# EAGLE schematic Main (EAGLE 8.1.0)
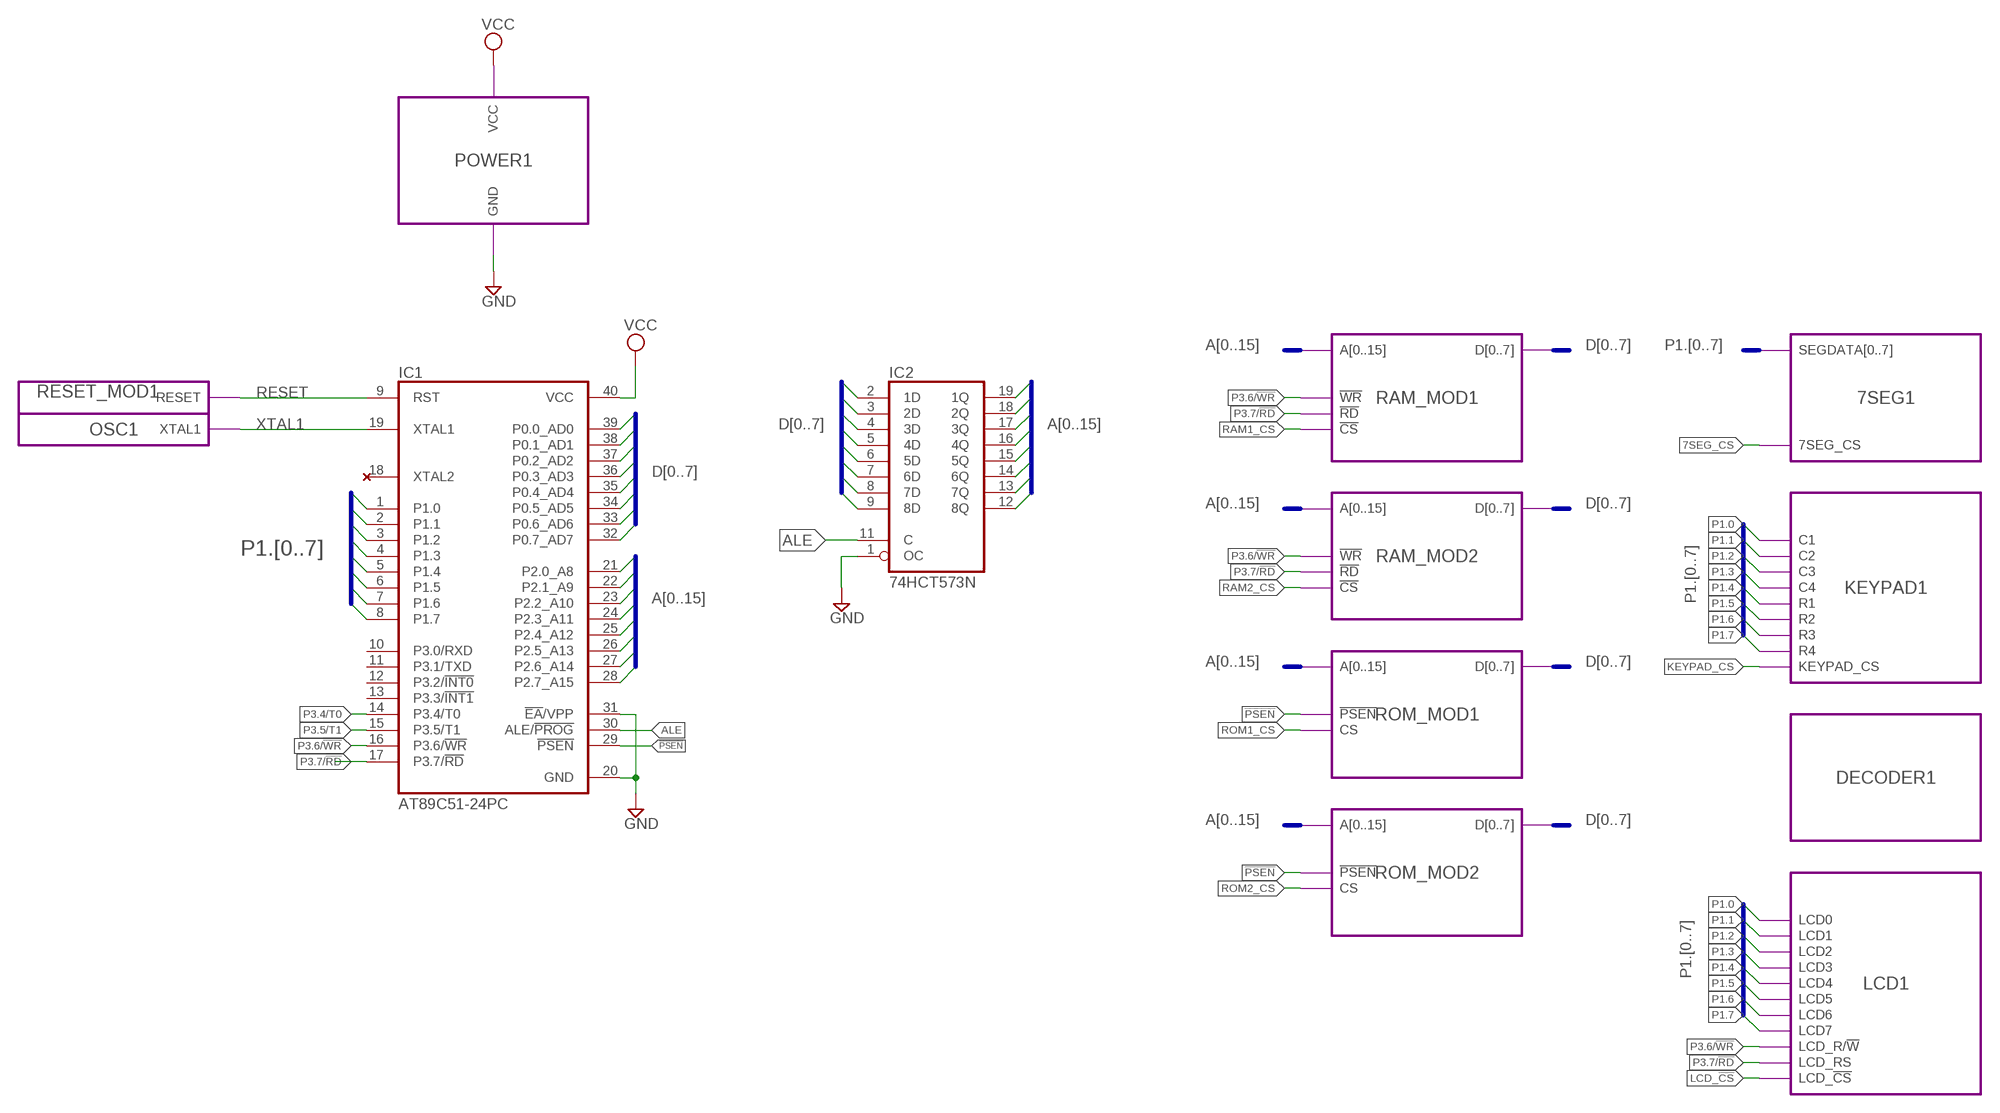
[diagram p0: schematic, sheet 1]

## Parts
IC1  AT89C51-24PC  [DIL40]
IC2  74HCT573N  [DIL20]
U$1  NC  [NC]

## Module instances
RAM_MOD1 = RAM_MODULE
RESET_MOD1 = RESET_MOD
OSC1 = OSCILLATOR
POWER1 = POWER_MOD
RAM_MOD2 = RAM_MODULE
ROM_MOD1 = ROM_MODULE
ROM_MOD2 = ROM_MODULE
7SEG1 = 7-SEGMENT
KEYPAD1 = KPAD_MOD
DECODER1 = DECODER_MODULE
LCD1 = LCD_MODULE

## Nets
7SEG_CS: port 7SEG1.7SEG_CS
!PSEN!: IC1.29(!PSEN) ; port ROM_MOD1.!PSEN! ROM_MOD2.!PSEN!
A0: IC2.19(1Q)
A1: IC2.18(2Q)
A2: IC2.17(3Q)
A3: IC2.16(4Q)
A4: IC2.15(5Q)
A5: IC2.14(6Q)
A6: IC2.13(7Q)
A7: IC2.12(8Q)
A8: IC1.21(P2.0_A8)
A9: IC1.22(P2.1_A9)
A10: IC1.23(P2.2_A10)
A11: IC1.24(P2.3_A11)
A12: IC1.25(P2.4_A12)
A13: IC1.26(P2.5_A13)
A14: IC1.27(P2.6_A14)
A15: IC1.28(P2.7_A15)
ALE: IC1.30(ALE/!PROG) IC2.11(C)
D0: IC1.39(P0.0_AD0) IC2.2(1D)
D1: IC1.38(P0.1_AD1) IC2.3(2D)
D2: IC1.37(P0.2_AD2) IC2.4(3D)
D3: IC1.36(P0.3_AD3) IC2.5(4D)
D4: IC1.35(P0.4_AD4) IC2.6(5D)
D5: IC1.34(P0.5_AD5) IC2.7(6D)
D6: IC1.33(P0.6_AD6) IC2.8(7D)
D7: IC1.32(P0.7_AD7) IC2.9(8D)
GND: IC1.20(GND) IC1.31(!EA!/VPP) IC2.1(OC) ; port POWER1.GND
KEYPAD_CS: port KEYPAD1.KEYPAD_CS
LCD_!CS!: port LCD1.LCD_!CS
P1.0: IC1.1(P1.0) ; port KEYPAD1.C1 LCD1.LCD0
P1.1: IC1.2(P1.1) ; port KEYPAD1.C2 LCD1.LCD1
P1.2: IC1.3(P1.2) ; port KEYPAD1.C3 LCD1.LCD2
P1.3: IC1.4(P1.3) ; port KEYPAD1.C4 LCD1.LCD3
P1.4: IC1.5(P1.4) ; port KEYPAD1.R1 LCD1.LCD4
P1.5: IC1.6(P1.5) ; port KEYPAD1.R2 LCD1.LCD5
P1.6: IC1.7(P1.6) ; port KEYPAD1.R3 LCD1.LCD6
P1.7: IC1.8(P1.7) ; port KEYPAD1.R4 LCD1.LCD7
P3.4/T0: IC1.14(P3.4/T0)
P3.5/T1: IC1.15(P3.5/T1)
P3.6/!WR!: IC1.16(P3.6/!WR) ; port RAM_MOD1.!WR! RAM_MOD2.!WR! LCD1.LCD_R/!W
P3.7/!RD!: IC1.17(P3.7/!RD) ; port RAM_MOD1.!RD! RAM_MOD2.!RD! LCD1.LCD_RS
RAM1_CS: port RAM_MOD1.!CS!
RAM2_CS: port RAM_MOD2.!CS!
RESET: IC1.9(RST) ; port RESET_MOD1.RESET
ROM1_CS: port ROM_MOD1.CS
ROM2_CS: port ROM_MOD2.CS
VCC: IC1.40(VCC) ; port POWER1.VCC
XTAL1: IC1.19(XTAL1) ; port OSC1.XTAL1
Unconnected: IC1.10(P3.0/RXD) IC1.11(P3.1/TXD) IC1.12(P3.2/!INT0) IC1.13(P3.3/!INT1) IC1.18(XTAL2)

## Buses
P1.[0..7]
A[0..15]
D[0..7]

## Power pins joined to a net without a drawn wire
GND: IC2.10(GND)
VCC: IC2.20(VCC)

## Library data of the parts
IC1 = atmel:AT89C51-*: 8-bit Microcontroller with 4K Bytes Flash Not Recommended for New Designs. Use AT89S51. Source: http://www.atmel.com/dyn/resources/prod_documents/doc0265.; OC_FARNELL: unknown; OC_NEWARK: unknown
IC2 = 74xx-eu:74*573: 8-bit D latch BUS DRIVER
U$1 = Miscellaneous:NC: No Connect - NC Package created by Collin MD Peterson Description: No Connect Symbol without any pins (empty package associated with symbol)

## Module RAM_MODULE
Ports: D[0..7](io) A[0..15](in) !WR!(in) !RD!(in) !CS!(in)
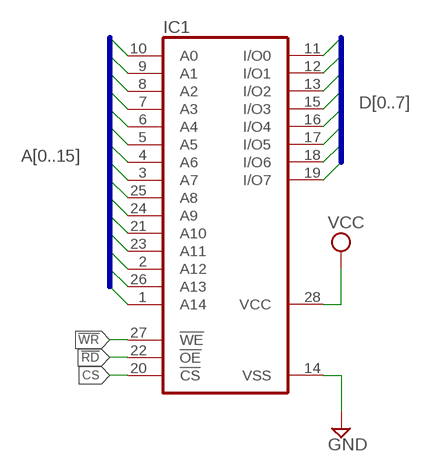
[diagram p1: schematic, module RAM_MODULE, sheet 1]

### Parts
IC1  62256P  [DIL28-6]

### Nets
!RD!: IC1.22(!OE)
!WR!: IC1.27(!WE)
A0: IC1.10(A0)
A1: IC1.9(A1)
A2: IC1.8(A2)
A3: IC1.7(A3)
A4: IC1.6(A4)
A5: IC1.5(A5)
A6: IC1.4(A6)
A7: IC1.3(A7)
A8: IC1.25(A8)
A9: IC1.24(A9)
A10: IC1.21(A10)
A11: IC1.23(A11)
A12: IC1.2(A12)
A13: IC1.26(A13)
A14: IC1.1(A14)
CS: IC1.20(!CS)
D0: IC1.11(I/O0)
D1: IC1.12(I/O1)
D2: IC1.13(I/O2)
D3: IC1.15(I/O3)
D4: IC1.16(I/O4)
D5: IC1.17(I/O5)
D6: IC1.18(I/O6)
D7: IC1.19(I/O7)
GND: IC1.14(VSS)
VCC: IC1.28(VCC)

### Buses
A[0..15]
D[0..7]

### Library data of the parts
IC1 = memory-hitachi:62256P: MEMORY; OC_FARNELL: unknown; OC_NEWARK: unknown

## Module RESET_MOD
Ports: RESET(out)
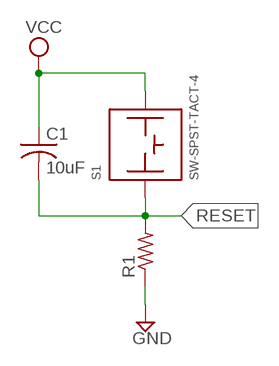
[diagram p2: schematic, module RESET_MOD, sheet 1]

### Parts
C1  10uF  C-US025-025X050  [C025-025X050]
R1  R-US_0207/10  [0207/10]
S1  SW-SPST-TACT-4  [SW-SPST-TACT-4]

### Nets
GND: R1.1
RESET: C1.2 R1.2 S1.1B
VCC: C1.1 S1.2A(2B)
Unconnected: S1.1A S1.2B(2A)

### Library data of the parts
C1 = rcl:C-US: CAPACITOR, American symbol
R1 = rcl:R-US_: RESISTOR, American symbol
S1 = Switches:SW-SPST-TACT-4: SW-SPST-TACT-4 - Tactile Switch (Pushbutton) Package created by Collin MD Peterson Description: Single-Pull, Single-Throw Tactile Pushbutton 4 pins (1A & 1B connected, 2A & 2B connected) Uses swap level 0 (pins 1A and 2A) and 1 (pins 1B and 2B) Dimensions: Pins: Size: 6.5mm x 4.5mm Diameter: 1mm Case: Size: 6mm x 6mm Works For: TF25 Through Hole

## Module OSCILLATOR
Ports: XTAL1(out)
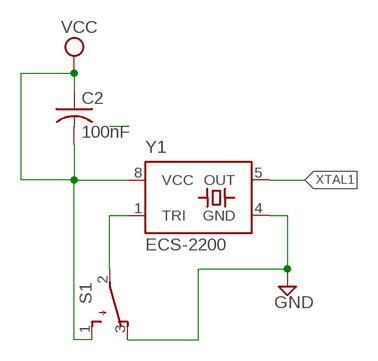
[diagram p3: schematic, module OSCILLATOR, sheet 1]

### Parts
C2  100nF  C-US025-025X050  [C025-025X050]
S1  SW-SPDT-TOG-3  [SW-SPDT-TOG-3]
Y1  ECS-2200  [ECS-2200]

### Nets
GND: S1.3 Y1.4(GND)
N$2: S1.2 Y1.1(TRI)
VCC: C2.1 C2.2 S1.1 Y1.8(VCC)
XTAL1: Y1.5(OUT)

### Library data of the parts
C2 = rcl:C-US: CAPACITOR, American symbol
S1 = Switches:SW-SPDT-TOG-3: SW-SPDT-TOG-3 - Toggle Switch Package created by Collin MD Peterson Description: Single-Pull, Double-Throw Toggle Switch 3 pin (1 = position 1, 2 = common, 3 = position 3) Dimensions: Pins: Size: 75mil x 400mil Diameter: 75mil Case: Size: 500mil x 270mil Works For: 100SP1 Through Hole
Y1 = Oscillators:ECS-2200: ECS-2200 Series - Clock Oscillator Package created by Collin MD Peterson Specs: ECS-2200B 12.000 MHz Dimensions: Pins: Size: 7.62mm x 7.62mm Diameter: 0.5mm Case: Size: 13.2mm x 13.2mm

## Module POWER_MOD
Ports: VCC(pwr) GND(pwr)
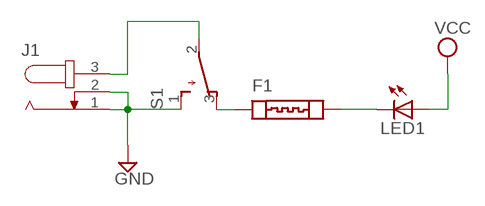
[diagram p4: schematic, module POWER_MOD, sheet 1]

### Parts
F1  FUSE-5X20  [FUSE-5X20]
J1  JACK-PLUG0  [SPC4077]
LED1  LED5MM  [LED5MM]
S1  SW-SPDT-TOG-3  [SW-SPDT-TOG-3]

### Nets
GND: J1.1 J1.2 S1.1
N$1: F1.2A LED1.K(C)
N$2: F1.1A S1.3
N$5: J1.3 S1.2
VCC: LED1.A
Unconnected: F1.1B F1.2B

### Library data of the parts
F1 = Fuses:FUSE-5X20: Generic Fuse Holder - 4 pin Package created by Collin MD Peterson Description: 4 pins (1A & 1B connected, 2A & 2B connected) Uses swap level 0 (pins 1A and 2A) and 1 (pins 1B and 2B) Dimensions: Fuse: F2400-ND (217 Series, 5x20mm, 200x800mil) Holder: F4189-ND (4.8mm x 3.8mm) Pins: 200mil x 700mil
J1 = con-jack:JACK-PLUG: DC POWER JACK Power Jack, DC, Right Angle, Through Hole, Rated 5A at 16VDC, PC Terminals Distributor: Farnell (www.Farnell.de) Drawing: 84N1161.pdf / 84N1162.pdf Manufacturer: SPC Technology (www.spctechnology.com) Type: SPC4077 / SPC 4078; OC_FARNELL: unknown; OC_NEWARK: unknown
LED1 = led:LED: LED OSRAM: - CHIPLED LG R971, LG N971, LY N971, LG Q971, LY Q971, LO R971, LY R971 LH N974, LH R974 LS Q976, LO Q976, LY Q976 LO Q996 - Hyper CHIPLED LW Q18S LB Q993, LB Q99A, LB R99A - SideLED LS A670, LO A670, LY A670, LG A670, LP A670 LB A673, LV A673, LT A673, LW A673 LH A674 LY A675 LS A676, LA A676, LO A676, LY A676, LW A676 LS A679, LY A679, LG A679 - Hyper Micro SIDELED® LS Y876, LA Y876, LO Y876, LY Y876 LT Y87S - SmartLED LW L88C, LW L88S LB L89C, LB L89S, LG L890 LS L89K, LO L89K, LY L89K LS L896, LA L896, LO L896, LY L896 - TOPLED LS T670, LO T670, LY T670, LG T670, LP T670 LSG T670, LSP T670, LSY T670, LOP T670, LYG T670 LG T671, LOG T671, LSG T671 LB T673, LV T673, LT T673, LW T673 LH T674 LS T676, LA T676, LO T676, LY T676, LB T676, LH T676, LSB T676, LW T676 LB T67C, LV T67C, LT T67C, LS T67K, LO T67K, LY T67K, LW E67C LS E67B, LA E67B, LO E67B, LY E67B, LB E67C, LV E67C, LT E67C LW T67C LS T679, LY T679, LG T679 LS T770, LO T770, LY T770, LG T770, LP T770 LB T773, LV T773, LT T773, LW T773 LH T774 LS E675, LA E675, LY E675, LS T675 LS T776, LA T776, LO T776, LY T776, LB T776 LHGB T686 LT T68C, LB T68C - Hyper Mini TOPLED® LB M676 - Mini TOPLED Santana® LG M470 LS M47K, LO M47K, LY M47K Source: http://www.osram.convergy.de LUXEON: - LUMILED® LXK2-PW12-R00, LXK2-PW12-S00, LXK2-PW14-U00, LXK2-PW14-V00 LXK2-PM12-R00, LXK2-PM12-S00, LXK2-PM14-U00 LXK2-PE12-Q00, LXK2-PE12-R00, LXK2-PE12-S00, LXK2-PE14-T00, LXK2-PE14-U00 LXK2-PB12-K00, LXK2-PB12-L00, LXK2-PB12-M00, LXK2-PB14-N00, LXK2-PB14-P00, LXK2-PB14-Q00 LXK2-PR12-L00, LXK2-PR12-M00, LXK2-PR14-Q00, LXK2-PR14-R00 LXK2-PD12-Q00, LXK2-PD12-R00, LXK2-PD12-S00 LXK2-PH12-R00, LXK2-PH12-S00 LXK2-PL12-P00, LXK2-PL12-Q00, LXK2-PL12-R00 Source: www.luxeon.com KINGBRIGHT: KA-3528ASYC Source: www.kingbright.com
S1 = Switches:SW-SPDT-TOG-3: SW-SPDT-TOG-3 - Toggle Switch Package created by Collin MD Peterson Description: Single-Pull, Double-Throw Toggle Switch 3 pin (1 = position 1, 2 = common, 3 = position 3) Dimensions: Pins: Size: 75mil x 400mil Diameter: 75mil Case: Size: 500mil x 270mil Works For: 100SP1 Through Hole

## Module ROM_MODULE
Ports: A[0..15](in) D[0..7](io) !PSEN!(in) CS(in)
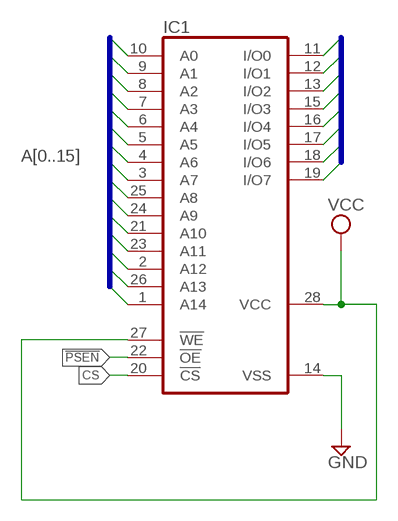
[diagram p5: schematic, module ROM_MODULE, sheet 1]

### Parts
IC1  62256P  [DIL28-6]

### Nets
!PSEN!: IC1.22(!OE)
A0: IC1.10(A0)
A1: IC1.9(A1)
A2: IC1.8(A2)
A3: IC1.7(A3)
A4: IC1.6(A4)
A5: IC1.5(A5)
A6: IC1.4(A6)
A7: IC1.3(A7)
A8: IC1.25(A8)
A9: IC1.24(A9)
A10: IC1.21(A10)
A11: IC1.23(A11)
A12: IC1.2(A12)
A13: IC1.26(A13)
A14: IC1.1(A14)
CS: IC1.20(!CS)
D0: IC1.11(I/O0)
D1: IC1.12(I/O1)
D2: IC1.13(I/O2)
D3: IC1.15(I/O3)
D4: IC1.16(I/O4)
D5: IC1.17(I/O5)
D6: IC1.18(I/O6)
D7: IC1.19(I/O7)
GND: IC1.14(VSS)
VCC: IC1.27(!WE) IC1.28(VCC)

### Buses
A[0..15]
D[0..7]

### Library data of the parts
IC1 = Memories:62256P: MEMORY; OC_FARNELL: unknown; OC_NEWARK: unknown

## Module 7-SEGMENT
Ports: SEGDATA[0..7](in) 7SEG_CS(in)
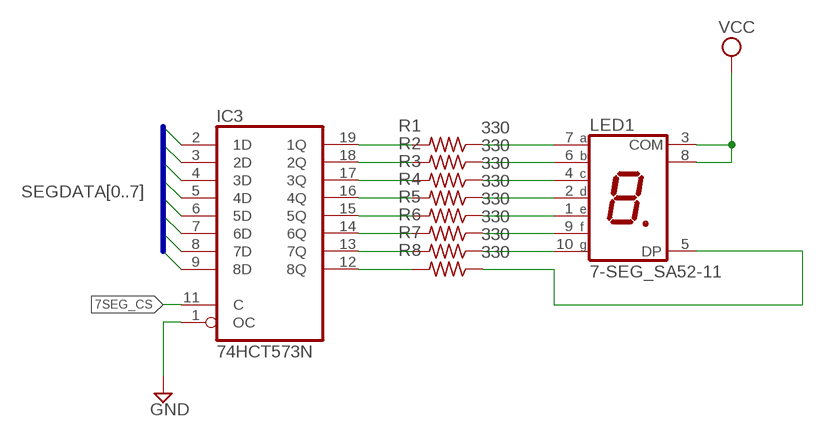
[diagram p6: schematic, module 7-SEGMENT, sheet 1]

### Parts
IC3  74HCT573N  [DIL20]
LED1  7-SEG_SA52-11  [SA52-11]
R1  330  R-US_0207/10  [0207/10]
R2  330  R-US_0207/10  [0207/10]
R3  330  R-US_0207/10  [0207/10]
R4  330  R-US_0207/10  [0207/10]
R5  330  R-US_0207/10  [0207/10]
R6  330  R-US_0207/10  [0207/10]
R7  330  R-US_0207/10  [0207/10]
R8  330  R-US_0207/10  [0207/10]

### Nets
7SEG_CS: IC3.11(C)
GND: IC3.1(OC)
N$1: IC3.19(1Q) R1.2
N$2: IC3.18(2Q) R2.2
N$3: IC3.17(3Q) R3.2
N$4: IC3.16(4Q) R4.2
N$5: IC3.15(5Q) R5.2
N$6: IC3.14(6Q) R6.2
N$7: IC3.13(7Q) R7.2
N$8: IC3.12(8Q) R8.2
N$9: LED1.7(A) R1.1
N$10: LED1.6(B) R2.1
N$11: LED1.4(C) R3.1
N$12: LED1.2(D) R4.1
N$13: LED1.1(E) R5.1
N$14: LED1.9(F) R6.1
N$15: LED1.10(G) R7.1
N$16: LED1.5(DP) R8.1
SEGDATA0: IC3.2(1D)
SEGDATA1: IC3.3(2D)
SEGDATA2: IC3.4(3D)
SEGDATA3: IC3.5(4D)
SEGDATA4: IC3.6(5D)
SEGDATA5: IC3.7(6D)
SEGDATA6: IC3.8(7D)
SEGDATA7: IC3.9(8D)
VCC: LED1.3(COM) LED1.8(COM)

### Buses
SEGDATA[0..7]

### Power pins joined to a net without a drawn wire
GND: IC3.10(GND)
VCC: IC3.20(VCC)

### Library data of the parts
IC3 = 74xx-eu:74*573: 8-bit D latch BUS DRIVER
LED1 = display-kingbright:7-SEG_: Kingbright 14.2mm (0.56 INCH) SINGLE DIGIT NUMERIC DUISPLAY Source: SA56-11EWA(Ver1189471036.pdf; OC_FARNELL: unknown; OC_NEWARK: unknown
R1-R8 = rcl:R-US_: RESISTOR, American symbol

## Module KPAD_MOD
Ports: C1(out) C2(out) C3(out) C4(out) R1(in) R2(in) R3(in) R4(in) KEYPAD_CS(in)
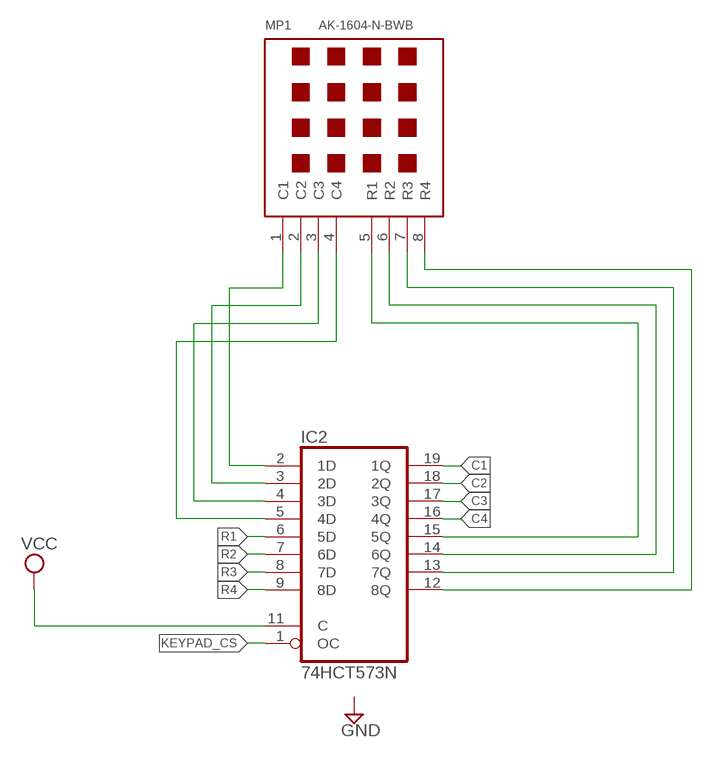
[diagram p7: schematic, module KPAD_MOD, sheet 1]

### Parts
IC2  74HCT573N  [DIL20]
MP1  AK-1604-N-BWB  [AK-1604-N-BWB]

### Nets
C1: IC2.19(1Q)
C2: IC2.18(2Q)
C3: IC2.17(3Q)
C4: IC2.16(4Q)
KEYPAD_CS: IC2.1(OC)
N$1: IC2.2(1D) MP1.1(C1)
N$2: IC2.3(2D) MP1.2(C2)
N$3: IC2.4(3D) MP1.3(C3)
N$4: IC2.5(4D) MP1.4(C4)
N$5: IC2.12(8Q) MP1.8(R4)
N$6: IC2.13(7Q) MP1.7(R3)
N$7: IC2.14(6Q) MP1.6(R2)
N$8: IC2.15(5Q) MP1.5(R1)
R1: IC2.6(5D)
R2: IC2.7(6D)
R3: IC2.8(7D)
R4: IC2.9(8D)
VCC: IC2.11(C)

### Power pins joined to a net without a drawn wire
GND: IC2.10(GND)
VCC: IC2.20(VCC)

### Library data of the parts
IC2 = 74xx-eu:74*573: 8-bit D latch BUS DRIVER
MP1 = Keypads:AK-1604-N-BWB: AK-1604-N-BWB - 4x4 Matrix Keypad Package created by Collin MD Peterson Description: 4 row x 4 column keypad Circuit Diagram: Col # : |_Col 1_|_Col 2_|_Col 3_|_Col 4_| Row 1: |__1___|__2___|__3___|__ A__| Row 2: |__4___|__5___|__6___|__ B__| Row 3: |__7___|__8___|__9___|__C__| Row 4: |__*___|__0___|__#___|__D__| Pin Arrangement: Pin 1: Column 1 Pin 2: Column 2 Pin 3: Column 3 Pin 4: Column 4 Pin 5: Row 1 Pin 6: Row 2 Pin 7: Row 3 Pin 8: Row 4

## Module DECODER_MODULE
Ports: 

### Library data of the parts

## Module LCD_MODULE
Ports: LCD0(io) LCD1(io) LCD2(io) LCD3(io) LCD4(io) LCD5(io) LCD6(io) LCD7(io) LCD_R/!W(in) LCD_RS(in) LCD_!CS(in)
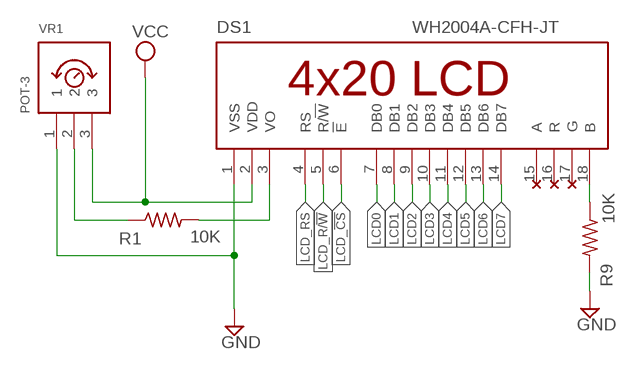
[diagram p8: schematic, module LCD_MODULE, sheet 1]

### Parts
DS1  WH2004A-CFH-JT  [WH2004A-CFH-JT]
R1  10K  R-US_0207/10  [0207/10]
R9  10K  R-US_0207/10  [0207/10]
U$1  NC  [NC]
U$2  NC  [NC]
U$3  NC  [NC]
VR1  POT-3  [POT-3]

### Nets
GND: DS1.1(VSS) R9.2 VR1.1
LCD0: DS1.7(DB0)
LCD1: DS1.8(DB1)
LCD2: DS1.9(DB2)
LCD3: DS1.10(DB3)
LCD4: DS1.11(DB4)
LCD5: DS1.12(DB5)
LCD6: DS1.13(DB6)
LCD7: DS1.14(DB7)
LCD_!CS: DS1.6(!E!)
LCD_R/!W: DS1.5(R/!W!)
LCD_RS: DS1.4(RS)
N$1: DS1.18(B) R9.1
N$2: DS1.3(VO) R1.2
N$3: R1.1 VR1.2
VCC: DS1.2(VDD) VR1.3

### Power pins joined to a net without a drawn wire
A: DS1.15(A)
G: DS1.17(G)
R: DS1.16(R)

### Library data of the parts
DS1 = Displays:WH2004A-CFH-JT: WH2004A-CFH-JT - 4x20 LCD Display Package created by Collin MD Peterson Description: 4 row x 20 column LCD Display Pin Arrangement: Pin 01: Vss (Ground) Pin 02: Vdd (5 V) Pin 03: VO (Operating Voltage: 10k-20k pot) Pin 04: RS Pin 05: R/W Pin 06: E Pin 07: Data 0 Pin 08: Data 1 Pin 09: Data 2 Pin 10: Data 3 Pin 11: Data 4 Pin 12: Data 5 Pin 13: Data 6 Pin 14: Data 7 Pin 15: Power supply for LED backlight (+) Pin 16: Power supply for LED backlight (Red) Pin 17: Power supply for LED backlight (Green) Pin 18: Power supply for LED backlight (Blue)
R1 R9 = rcl:R-US_: RESISTOR, American symbol
U$1-U$3 = Miscellaneous:NC: No Connect - NC Package created by Collin MD Peterson Description: No Connect Symbol without any pins (empty package associated with symbol)
VR1 = Resistors:POT-3: POT-3 - Potentiometer Package created by Collin MD Peterson Description: 3 pins in a row Dimensions: Pins: Size: 40mil x 300mil Diameter: 40mil Case: Size: 375mil x 375mil Works For: 306E-103 (10k) Through Hole